# EAGLE design Cansat2019_3279_Container_v03 (EAGLE 7.3.0)
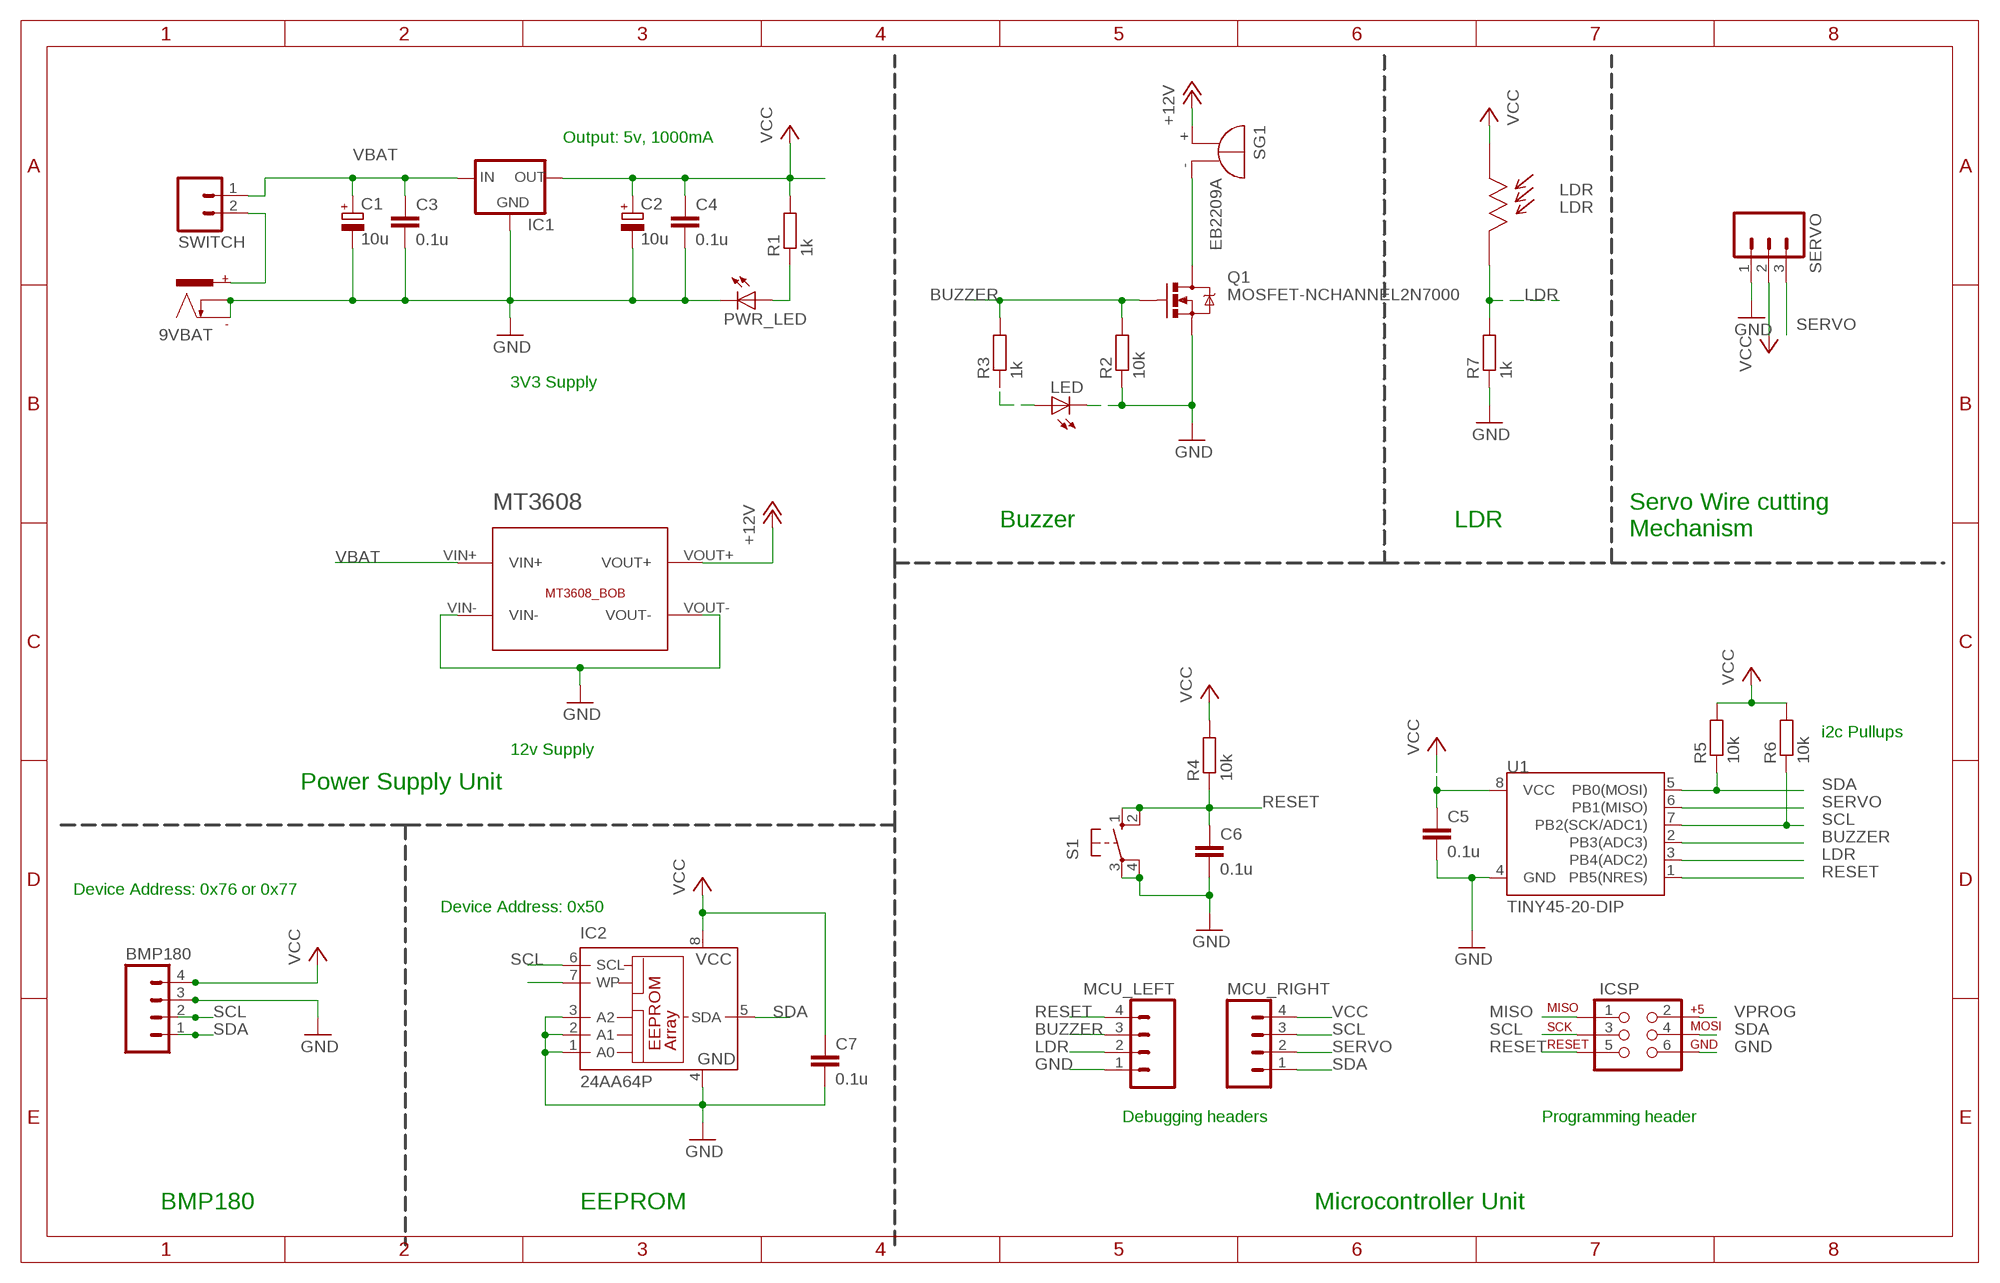
[diagram p0: schematic, sheet 1]

## Parts
9VBAT  POWER_CON  [NEB21R]
BMP180  M04  [04P]
C1  10u  CPOL-EUE2.5-6  [E2,5-6]
C2  10u  CPOL-EUE2.5-6  [E2,5-6]
C3  0.1u  C-EU025-025X050  [C025-025X050]
C4  0.1u  C-EU025-025X050  [C025-025X050]
C5  0.1u  C-EU025-025X050  [C025-025X050]
C6  0.1u  C-EU025-025X050  [C025-025X050]
C7  0.1u  C-EU025-025X050  [C025-025X050]
IC1  V_REG_78XX-TO-220  [TO-220-ALT]
IC2  24AA64P  [DIL8]
ICSP  AVR_SPI_PRG_6NS  [2X3-NS]
LDR  LDR  [LDR-5MM]
LED  LED3MM  [LED3MM]
MCU_LEFT  M04  [04P]
MCU_RIGHT  M04  [04P]
MT3608  MT3608_BOB  [MT3608_BOB]
PWR_LED  LED3MM  [LED3MM]
Q1  MOSFET-NCHANNEL2N7000  [TO-92]
R1  1k  R-EU_0204/7  [0204/7]
R2  10k  R-EU_0204/7  [0204/7]
R3  1k  R-EU_0204/7  [0204/7]
R4  10k  R-EU_0204/7  [0204/7]
R5  10k  R-EU_0204/7  [0204/7]
R6  10k  R-EU_0204/7  [0204/7]
R7  1k  R-EU_0204/7  [0204/7]
S1  PUSH-BUTTON-6MM  [B3F-10XX]
SERVO  M03  [03P]
SG1  EB2209A  [EB2209A]
SWITCH  M02  [02P]
U1  TINY45-20-DIP  ATTINY45TINY45-20-DIP  [DIP08]

## Nets
+12V [power]: MT3608.VOUT+ SG1.+
BUZZER: MCU_LEFT.3 Q1.2(G) R2.2 R3.2 U1.2(PB3(ADC3))
GND [power]: 9VBAT.- 9VBAT.C BMP180.3 C1.- C2.- C3.2 C4.2 C5.2 C6.2 C7.2 IC1.GND IC2.1(A0) IC2.2(A1) IC2.3(A2) IC2.4(GND) ICSP.6 LED.K(C) MCU_LEFT.1 MT3608.VIN- MT3608.VOUT- PWR_LED.K(C) Q1.1(S) R2.1 R7.1 S1.3(P) S1.4(P1) SERVO.1 U1.4(GND)
LDR: LDR.P$2 MCU_LEFT.2 R7.2 U1.3(PB4(ADC2))
MISO: ICSP.1
N$1 [power]: Q1.3(D) SG1.-
N$2: LED.A R3.1
N$3: PWR_LED.A R1.1
N$6 [burner]: 9VBAT.+ SWITCH.2
N$8: IC2.7(WP)
RESET: C6.1 ICSP.5 MCU_LEFT.4 R4.1 S1.1(S) S1.2(S1) U1.1(PB5(NRES))
SCL: BMP180.2 IC2.6(SCL) ICSP.3 MCU_RIGHT.3 R6.1 U1.7(PB2(SCK/ADC1))
SDA: BMP180.1 IC2.5(SDA) ICSP.4 MCU_RIGHT.1 R5.1 U1.5(PB0(MOSI))
SERVO: MCU_RIGHT.2 SERVO.3 U1.6(PB1(MISO))
VBAT [burner]: C1.+ C3.1 IC1.IN MT3608.VIN+ SWITCH.1
VCC [power]: BMP180.4 C2.+ C4.1 C5.1 C7.1 IC1.OUT IC2.8(VCC) LDR.P$1 MCU_RIGHT.4 R1.2 R4.2 R5.2 R6.2 SERVO.2 U1.8(VCC)
VPROG [power]: ICSP.2

## Notes on the sheet
- Output: 5v, 1000mA
- 3V3 Supply
- Buzzer | LDR
- Servo Wire cutting
  Mechanism
- i2c Pullups
- 12v Supply
- Power Supply Unit
- Device Address: 0x76 or 0x77
- Device Address: 0x50
- Debugging headers | Programming header
- BMP180 | EEPROM | Microcontroller Unit

## Library data of the parts
9VBAT = CEDT_JANUARY_2015_v5:POWER_CON: DC Power Connector
BMP180 MCU_LEFT MCU_RIGHT = con-amp-quick:M04: AMP QUICK CONNECTOR; OC_FARNELL: unknown; OC_NEWARK: unknown
C1 C2 = rcl:CPOL-EU: POLARIZED CAPACITOR, European symbol
C3-C7 = rcl:C-EU: CAPACITOR, European symbol
IC1 = 1 - Jim:V_REG_78XX: Voltage Regulator Standard 7805 5V regulator. IGO (Input Ground Output). Spark Fun Electronics SKU : COM-00107
IC2 = microchip:24*: Serial EEPROM I2C; MF: MICROCHIP; MPN: 24AA64-I/P; OC_FARNELL: 1331303; OC_NEWARK: 92C6909
ICSP = SparkFun-Connectors:AVR_SPI_PRG_6: AVR ISP 6 Pin This is the reduced ISP connector for AVR programming. Common on Arduino. This footprint will take up less PCB space and can be used with a 10-pin to 6-pin adapter such as SKU: BOB-08508 **Special note about "TEST_POINT" package. The stop mask is on the top side, so if you want your programming test points to be on the bottom of your board, make sure to place this package on the bottom side of the board. This also ensure that the orientation to program from the bottom side will be correct.
LDR = msp framework:LDR: Light Dependent Resistor Sunrom Product Page <http://www.sunrom.com/p/ldr-5mm-light-dependent-resistor>; SUNROM: 3190
LED PWR_LED = 01_adafruit:LED: LED OSRAM: - CHIPLED LG R971, LG N971, LY N971, LG Q971, LY Q971, LO R971, LY R971 LH N974, LH R974 LS Q976, LO Q976, LY Q976 LO Q996 - Hyper CHIPLED LW Q18S LB Q993, LB Q99A, LB R99A - SideLED LS A670, LO A670, LY A670, LG A670, LP A670 LB A673, LV A673, LT A673, LW A673 LH A674 LY A675 LS A676, LA A676, LO A676, LY A676, LW A676 LS A679, LY A679, LG A679 - Hyper Micro SIDELED® LS Y876, LA Y876, LO Y876, LY Y876 LT Y87S - SmartLED LW L88C, LW L88S LB L89C, LB L89S, LG L890 LS L89K, LO L89K, LY L89K LS L896, LA L896, LO L896, LY L896 - TOPLED LS T670, LO T670, LY T670, LG T670, LP T670 LSG T670, LSP T670, LSY T670, LOP T670, LYG T670 LG T671, LOG T671, LSG T671 LB T673, LV T673, LT T673, LW T673 LH T674 LS T676, LA T676, LO T676, LY T676, LB T676, LH T676, LSB T676, LW T676 LB T67C, LV T67C, LT T67C, LS T67K, LO T67K, LY T67K, LW E67C LS E67B, LA E67B, LO E67B, LY E67B, LB E67C, LV E67C, LT E67C LW T67C LS T679, LY T679, LG T679 LS T770, LO T770, LY T770, LG T770, LP T770 LB T773, LV T773, LT T773, LW T773 LH T774 LS E675, LA E675, LY E675, LS T675 LS T776, LA T776, LO T776, LY T776, LB T776 LHGB T686 LT T68C, LB T68C - Hyper Mini TOPLED® LB M676 - Mini TOPLED Santana® LG M470 LS M47K, LO M47K, LY M47K Source: http://www.osram.convergy.de/
MT3608 = Breakouts:MT3608_BOB
Q1 = SparkFun-DiscreteSemi:MOSFET-NCHANNEL: Common NMOSFET Parts MFG P/N Store ID Prod ID FDD8780 TRANS-09984 SI7820DN TRANS-11055 FDS6630A IC-08089 2N7002PW TRANS-11151 FQP30N06L COM-10213 TRANS-10060 BSS123LT1G TRANS-08345 BSS138 TRANS-00830 BS170 2N7000
R1-R7 = rcl:R-EU_: RESISTOR, European symbol
S1 = msp framework:PUSH-BUTTON: Tactile Switch Momentary Push to ON switch Omron B3F 10-xx & 40-xx Datasheet <http://www.omron.com/ecb/products/pdf/en-b3f.pdf>; SUNROM: 3951
SERVO = msp framework:M03: AMP QUICK CONNECTOR
SG1 = buzzer:EB2209A: BUZZER Source: Buerklin; OC_FARNELL: unknown; OC_NEWARK: unknown
SWITCH = CEDT_JANUARY_2015_v5:M02: AMP QUICK CONNECTOR
U1 = SparkFun-DigitalIC:ATTINY45: Atmel 8-pin 2/4/8kB flash uC; PROD_ID: IC-09439

## Net classes
0 default: width 0.305 mm, clearance 0.305 mm
1 power: width 0.61 mm, clearance 0.305 mm
2 burner: width 0.813 mm, clearance 0.305 mm

## Board
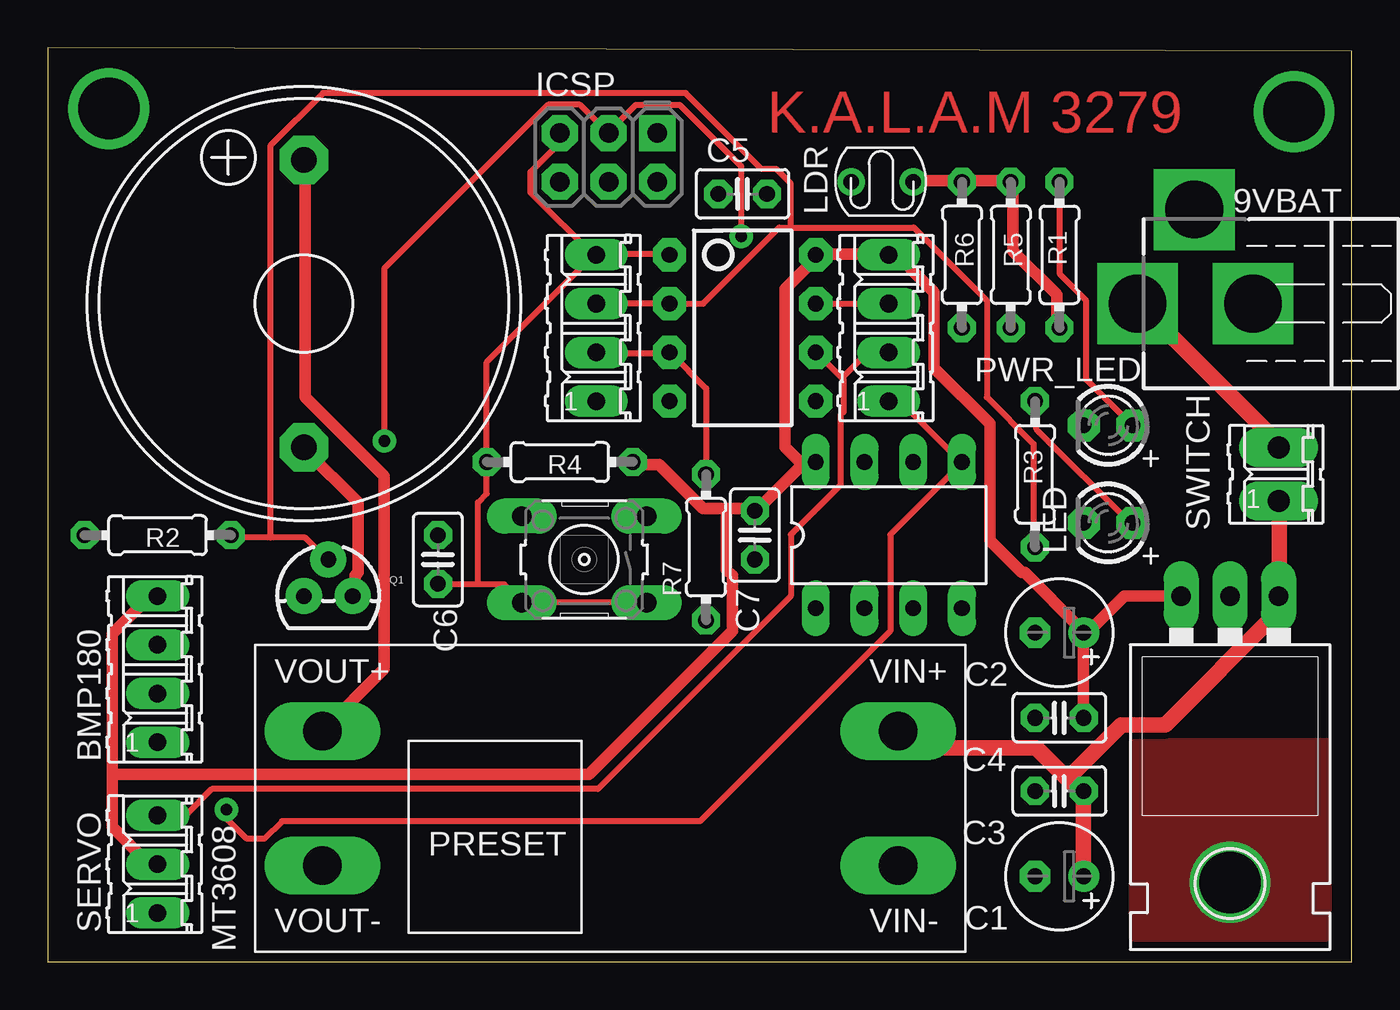
[diagram p1: board, top side]
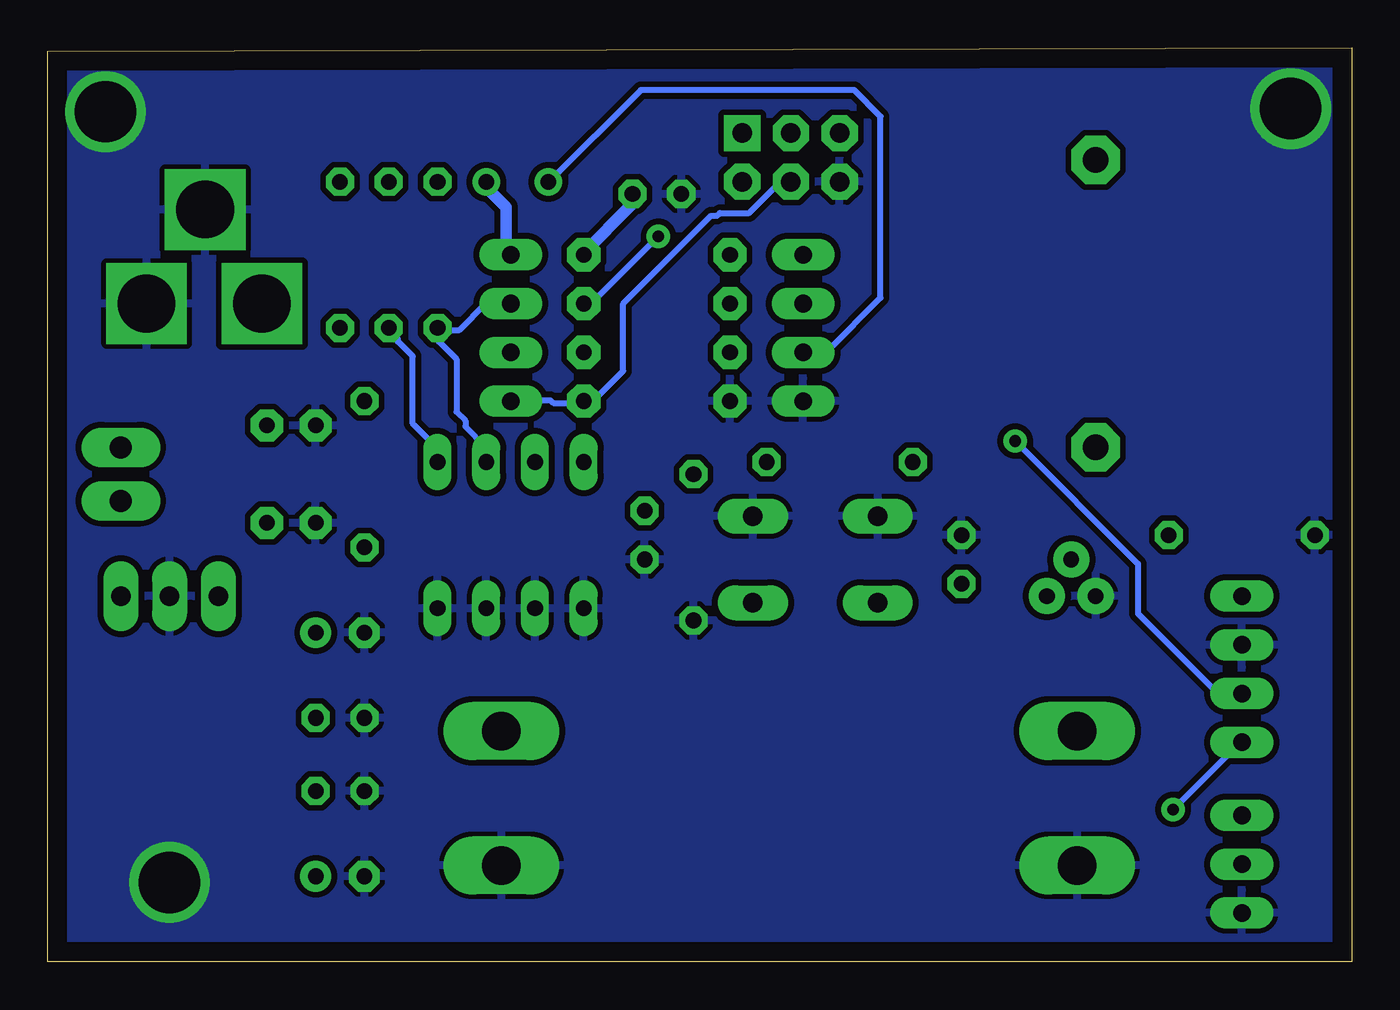
[diagram p2: board, bottom side, seen from below]

Size 67.92 x 47.61 mm. Coordinates in mm from the lower left corner, seen from the top.
Outline: 0,0 67.92,0 67.92,47.45 0,47.61 0,0
Copper layers (1*16): Top 0.035mm / dielectric 1.5mm / Bottom 0.035mm
Design rules "8085_board": minimum track width 10mil, minimum drill 24mil, track to track 8mil, track to pad 8mil, pad to pad 8mil, via to via 8mil, smd to smd 8mil, copper to edge 40mil, drill to drill 8mil, minimum pad ring 12mil, minimum via ring 12mil, stop-mask expansion 4mil, vias tented up to drill 0mil, thermal gap 10mil

### Footprints (pad centres in the part's own frame; a part is rotated, then mirrored left to right if it is on the bottom)
NEB21R = drill 3 pad 4.2 square: + 0,3.54; - 0,-2.46; C 4.9,0.59
04P = drill 0.914 long: 1 -3.81,0; 2 -1.27,0; 3 1.27,0; 4 3.81,0
E2,5-6 = drill 0.813 pad 1.6: + -1.27,0 | drill 0.813 pad 1.6 octagon: - 1.27,0
C025-025X050 = drill 0.813 octagon: 1 -1.27,0; 2 1.27,0
TO-220-ALT = drill 1.016 long: GND 0,-3.81; IN -2.54,-3.81; OUT 2.54,-3.81
DIL8 = drill 0.813 long: 1 -3.81,-3.81; 2 -1.27,-3.81; 3 1.27,-3.81; 4 3.81,-3.81; 5 3.81,3.81; 6 1.27,3.81; 7 -1.27,3.81; 8 -3.81,3.81
2X3-NS = drill 1.016 pad 1.88 square: 1 -2.54,-1.27 | drill 1.016 pad 1.88 octagon: 2 -2.54,1.27; 3 0,-1.27; 4 0,1.27; 5 2.54,-1.27; 6 2.54,1.27
LDR-5MM = drill 0.8: P$1 0,0; P$2 3.24,0
LED3MM = drill 0.813 pad 1.676 octagon: A -1.27,0; K 1.27,0
MT3608_BOB = drill 2 pad 3 long: VIN+ 33.5,-4.5; VIN- 33.5,-11.5; VOUT+ 3.5,-4.5; VOUT- 3.5,-11.5
TO-92 = drill 0.813 pad 1.88: 1 -1.27,0; 2 0,1.905; 3 1.27,0
0204/7 = drill 0.813 octagon: 1 -3.81,0; 2 3.81,0
B3F-10XX = drill 1.016 long: 1 -3.251,2.261; 2 3.251,2.261; 3 -3.251,-2.261; 4 3.251,-2.261
03P = drill 0.914 long: 1 -2.54,0; 2 0,0; 3 2.54,0
EB2209A = drill 1.321 pad 2.54 octagon: + 7.493,0; - -7.493,0
02P = drill 1.143 long: 1 -1.397,0; 2 1.397,0
DIP08 = drill 0.813 pad 1.727 octagon: 1 -3.81,-3.81; 2 -1.27,-3.81; 3 1.27,-3.81; 4 3.81,-3.81; 5 3.81,3.81; 6 1.27,3.81; 7 -1.27,3.81; 8 -3.81,3.81

### Placement (x,y rotation side)
9VBAT  60.33,34.29 90 top
BMP180  5.71,15.24 90 top
C1  52.7,4.45 180 top
C2  52.7,17.14 180 top
C3  52.7,8.89 180 top
C4  52.7,12.7 180 top
C5  36.2,40.01 180 top
C6  20.32,20.95 90 top
C7  36.83,22.23 270 top
IC1  61.59,15.24 180 top
IC2  43.81,22.23 0 top
ICSP  29.21,41.91 180 top
LDR  45.09,40.64 180 top
LED  55.24,22.86 180 top
MCU_LEFT  28.57,33.02 90 top
MCU_RIGHT  43.81,33.02 90 top
MT3608  10.79,16.51 0 top
PWR_LED  55.24,27.94 180 top
Q1  14.61,19.05 0 top
R1  52.7,36.83 270 top
R2  5.71,22.23 0 top
R3  51.44,25.4 270 top
R4  26.67,26.04 0 top
R5  50.16,36.83 90 top
R6  47.62,36.83 90 top
R7  34.29,21.59 90 top
S1  27.94,20.95 180 top
SERVO  5.71,5.08 90 top
SG1  13.34,34.29 90 top
SWITCH  64.14,25.4 90 top
U1  36.2,33.02 270 top

### Tracks (layer width: path | path; a pad name or v marks a point on that pad's centre or on a via)
+12V
  Top 0.61: SG1.+ 13.41,41.76 13.41,29.41 17.53,25.3 17.53,15.24 14.33,12.04 MT3608.VOUT+
BUZZER
  Top 0.305: 11.58,22.1 13.41,22.1 14.48,21.03 Q1.2 | 11.58,22.1 9.6,22.1 R2.2 | 38.71,38.25 38.1,38.25 34.14,34.29 U1.2 MCU_LEFT.3 | 38.71,38.25 45.11,38.25 48.92,34.44 48.92,29.41 51.36,26.98 51.36,21.64 R3.2 | 11.58,22.1 11.58,42.52 14.33,45.26 33.22,45.26 37.19,41.3 37.95,41.3 38.71,40.54 38.71,38.25
GND  (via drill 3.2)
  other vias: 3.17,44.45 64.93,44.29 61.59,4.13
  pour Bottom: -1.91,52.07 70.48,52.07 70.48,-1.27 -1.91,-1.27
  pour Top: 56.52,1.27 66.67,1.27 66.67,11.43 56.52,11.43
  pour Bottom: 56.52,1.27 66.67,1.27 66.67,11.43 56.52,11.43
LDR
  Top 0.305: R7.2 34.29,29.87 32.46,31.7 U1.3 32.31,31.7 28.65,31.7 MCU_LEFT.2
  Bottom 0.305: LDR.P$2 41.76,40.69 37.03,45.41 25.91,45.41 24.54,44.04 24.54,34.59 27.28,31.85 28.5,31.85 MCU_LEFT.2
N$1
  Top 0.61: Q1.3 16,19.05 16,20.12 16.15,20.27 16.15,23.93 13.41,26.67 SG1.-
N$2
  Top 0.305: R3.1 51.51,29.11 51.51,27.74 56.39,22.86 LED.A
N$3
  Top 0.305: R1.1 52.73,40.54 52.73,35.81 54.1,34.44 54.1,30.33 56.39,28.04 PWR_LED.A
N$6
  Top 0.813: SWITCH.2 64.01,26.82 64.01,27.13 56.84,34.29 9VBAT.+
RESET
  Top 0.305: MCU_LEFT.4 28.65,36.88 32.31,36.88 U1.1 | ICSP.5 26.67,42.67 25.15,41.15 25.15,40.08 28.5,36.73 MCU_LEFT.4 | 22.4,19.66 23.77,19.66 24.69,18.75 | 22.4,19.66 20.42,19.66 C6.1 | 22.4,19.66 22.4,23.93 22.86,24.38 R4.1 22.86,31.24 28.35,36.73 MCU_LEFT.4 | 24.69,18.75 31.09,18.75 S1.1 | 24.69,18.75 S1.2
SCL  (via drill 0.61)
  Top 0.305: U1.7 MCU_RIGHT.3 | v17.53,27.13 17.53,36.12 26.06,44.65 27.74,44.65 ICSP.3 29.26,43.28 30.63,44.65 32.92,44.65 36.12,41.45 v36.12,37.8
  Bottom 0.305: IC2.6 45.11,26.06 45.11,26.82 46.18,27.89 46.18,28.19 46.63,28.65 46.63,31.39 47.55,32.31 47.55,32.92 R6.1 47.4,32.92 46.48,32.92 45.11,34.29 MCU_RIGHT.3 | v17.53,27.13 11.12,20.73 11.12,18.14 7.01,14.02 5.79,14.02 BMP180.2 | U1.7 39.62,34.29 v36.12,37.8
SDA  (via drill 0.61)
  Top 0.305: MCU_RIGHT.1 43.89,29.11 44.5,29.11 47.55,26.06 IC2.5 47.55,25.91 43.89,22.25 43.89,17.22 33.98,7.32 12.19,7.32 11.28,6.4 10.36,6.4 9.3,7.47 v9.3,7.92
  Bottom 0.305: R5.1 50.14,32.92 49.68,32.46 49.68,32.31 48.92,31.55 48.92,28.04 47.7,26.82 47.7,26.06 IC2.5 | v9.3,7.92 5.79,11.43 BMP180.1 | MCU_RIGHT.1 43.74,29.26 41.76,29.26 41.6,29.11 40.08,29.11 U1.5 39.93,29.26 39.47,29.26 37.95,30.79 37.95,34.29 33.38,38.86 33.07,38.86 32.92,39.01 31.39,39.01 29.87,40.54 29.26,40.54 ICSP.4
SERVO
  Top 0.305: SERVO.3 7.16,7.62 8.53,8.99 28.65,8.99 38.71,19.05 38.71,22.25 41.3,24.84 41.3,28.5 41.45,28.65 41.45,30.33 41.38,30.4 | 41.38,30.4 40.08,31.7 U1.6 | 41.38,30.4 42.67,31.7 43.74,31.7 MCU_RIGHT.2
VBAT
  Top 0.813: SWITCH.1 64.16,23.93 64.16,19.05 IC1.IN 64.01,18.75 64.01,18.14 58.22,12.34 55.93,12.34 53.11,9.53 | C1.+ 53.95,4.57 53.95,8.84 C3.1 53.65,8.99 53.11,9.53 | 53.11,9.53 51.51,11.12 45.11,11.12 44.35,11.89 MT3608.VIN+
VCC
  Top 0.61: 3.35,9.75 3.35,17.07 5.33,19.05 BMP180.4 | 3.35,9.75 3.35,7.01 5.18,5.18 5.64,5.18 SERVO.2 | LDR.P$1 45.11,40.69 47.55,40.69 R6.2 47.85,40.69 50.14,40.69 R5.2 50.29,40.39 50.29,37.03 52.58,34.75 52.58,33.07 R1.2 | C4.1 53.95,12.8 53.95,17.07 C2.+ | IC1.OUT 56.08,19.05 54.25,17.22 C2.+ | 35.36,23.62 36.73,23.62 C7.1 37.03,23.62 39.32,25.91 | 35.36,23.62 34.14,23.62 31.85,25.91 30.48,25.91 R4.2 | 39.32,25.91 39.93,25.91 IC2.8 | 39.32,25.91 38.41,26.82 38.41,35.05 39.93,36.58 U1.8 40.08,36.88 43.74,36.88 MCU_RIGHT.4 44.04,37.03 46.18,34.9 46.18,30.94 49.07,28.04 49.07,21.95 50.75,20.27 50.9,20.27 53.8,17.37 C2.+ | 3.35,9.75 28.19,9.75 35.66,17.22 35.66,20.12 35.36,20.42 35.36,23.62
  Bottom 0.61: C5.1 37.49,39.93 37.49,39.47 40.08,36.88 U1.8 | LDR.P$1 44.96,40.54 44.96,40.23 44.04,39.32 44.04,37.03 43.89,36.88 MCU_RIGHT.4

### Text on the board
Top: K.A.L.A.M 3279